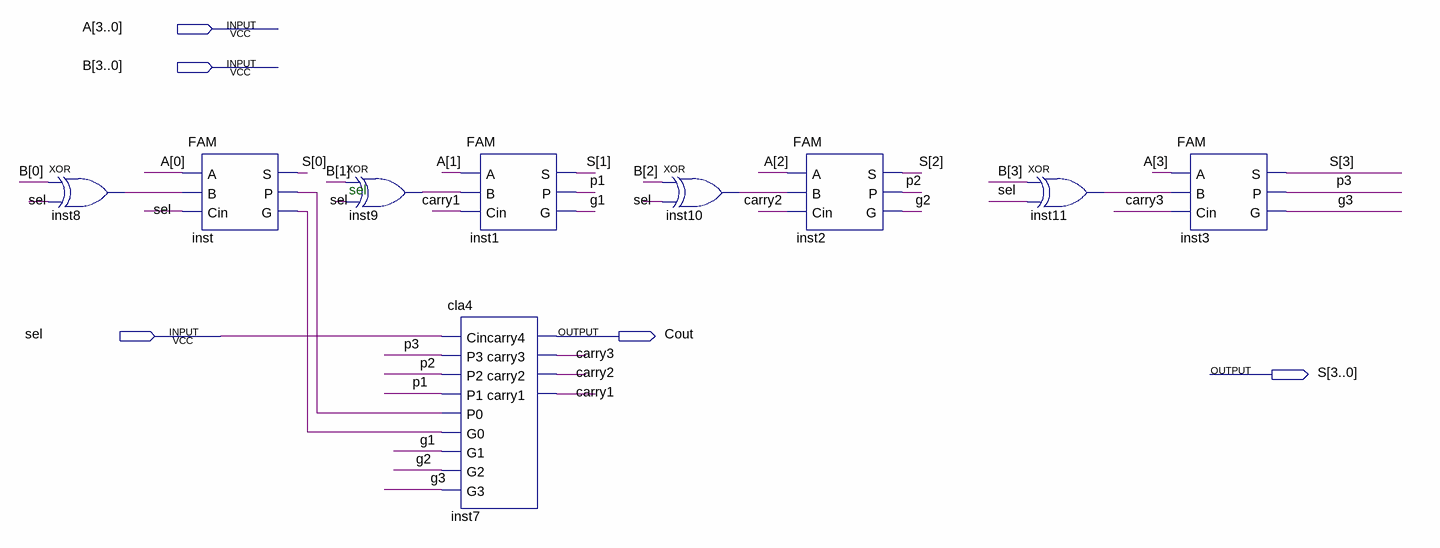
[diagram p0: schematic sheet]
// Quartus schematic clas4.bdf as structural Verilog: 9 symbols, 5 pins
module clas4 (
  input  [3:0] A,
  input  [3:0] B,
  input  sel,
  output Cout,
  output [3:0] S
);

  wire carry1, carry2, carry3, g1, g2, g3, inst8_out, inst9_out, inst10_out, inst11_out, inst_g, inst_p, p1,
       p2, p3;

  xor inst8 (inst8_out, B[0], sel);
  FAM inst (.A(A[0]), .B(inst8_out), .Cin(sel), .S(S[0]), .P(inst_p), .G(inst_g));
  xor inst9 (inst9_out, B[1], sel);
  FAM inst1 (.A(A[1]), .B(inst9_out), .Cin(carry1), .S(S[1]), .P(p1), .G(g1));
  cla4 inst7 (
    .Cin(sel), .P3(p3), .P2(p2), .P1(p1), .P0(inst_p), .G0(inst_g), .G1(g1), .G2(g2), .G3(g3), .carry4(Cout),
    .carry3(carry3), .carry2(carry2), .carry1(carry1));
  xor inst10 (inst10_out, B[2], sel);
  FAM inst2 (.A(A[2]), .B(inst10_out), .Cin(carry2), .S(S[2]), .P(p2), .G(g2));
  xor inst11 (inst11_out, B[3], sel);
  FAM inst3 (.A(A[3]), .B(inst11_out), .Cin(carry3), .S(S[3]), .P(p3), .G(g3));

  // Notes on the sheet:
  //   sel
endmodule
